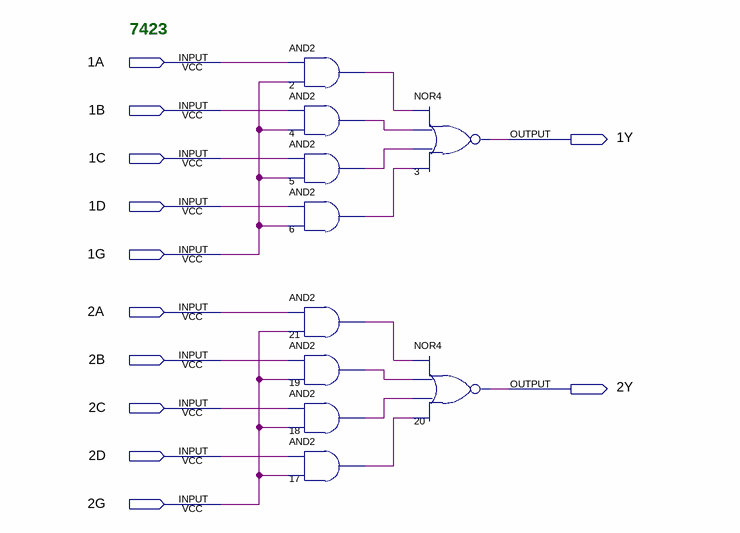
[diagram p0: schematic sheet]
// Quartus schematic 7423.bdf as structural Verilog: 10 symbols, 12 pins
module \7423  (
  input  \1A ,
  input  \1B ,
  input  \1C ,
  input  \1D ,
  input  \1G ,
  input  \2A ,
  input  \2B ,
  input  \2C ,
  input  \2D ,
  input  \2G ,
  output \1Y ,
  output \2Y 
);

  wire n2_out, n4_out, n5_out, n6_out, n17_out, n18_out, n19_out, n21_out;

  and u_2 (n2_out, \1A , \1G );
  and u_4 (n4_out, \1B , \1G );
  and u_5 (n5_out, \1C , \1G );
  and u_6 (n6_out, \1D , \1G );
  and u_21 (n21_out, \2A , \2G );
  and u_19 (n19_out, \2B , \2G );
  and u_18 (n18_out, \2C , \2G );
  and u_17 (n17_out, \2D , \2G );
  nor u_3 (\1Y , n2_out, n4_out, n5_out, n6_out);
  nor u_20 (\2Y , n21_out, n19_out, n18_out, n17_out);

  // Notes on the sheet:
  //   7423
endmodule
